# Altium project Second_Security.PrjPcb
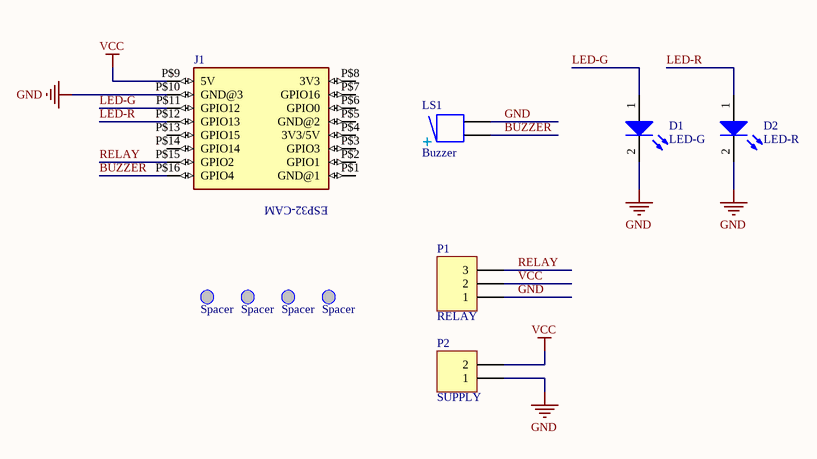
[diagram p0: SchematicDesign.SchDoc]
1 sheet, 10 parts. Net scope: global (net labels, ports and power ports of the same name join across sheets).
Board file: PCBDesign.PcbDoc

## Sheet SchematicDesign.SchDoc
size A4

### Parts
1  Spacer  [Spacer]
2  Spacer  [Spacer]
3  Spacer  [Spacer]
4  Spacer  [Spacer]
D1  LED-G  [LED]
D2  LED-R  [LED]
J1  ESP32-CAM  [ESP32-CAM]  (value not drawn)
LS1  Buzzer  [BUZZER]
P1  RELAY  [HDR1X3]
P2  SUPPLY  [Term.Block 2pin]

### Nets
GND: D1.2(K) D2.2(K) J1.P$10(GND@3) LS1.2 P1.1 P2.0(1)
VCC: J1.P$9(5V) P1.2 P2.1(2)
BUZZER: J1.P$16(GPIO4) LS1.1
LED-G: D1.1(A) J1.P$11(GPIO12)
LED-R: D2.1(A) J1.P$12(GPIO13)
RELAY: J1.P$15(GPIO2) P1.3

Not connected (* = marked no-connect by the designer): J1 P$1(GND@1) P$2(GPIO1) P$3(GPIO3) P$4(3V3/5V) P$5(GND@2) P$6(GPIO0) P$7(GPIO16) P$8(3V3) P$13(GPIO15) P$14(GPIO14)

### Library data of the parts
D1 D2 = LED: LED 3mm or 5mm; Published: 8-Jun-2000; LatestRevisionDate: 08-Jul-2005; LatestRevisionNote: Mech Layer 1 removed.; PackageReference: LED-1; Publisher: Altium Limited; PackageDescription: LED; 2 Leads
J1 = ESP32-CAM: ESP32 ESP32 Transceiver; 802.11 a/b/g/n (Wi-Fi, WiFi, WLAN), BluetoothÂ® Smart 4.x Low Energy (BLE) Evaluation Board; MF: AI-Thinker; SnapEDA_Link: https://www.snapeda.com/parts/ESP32-CAM/AI-Thinker/view-part/?ref=snap; Package: None; Value: *; MP: ESP32-CAM; Check_prices: https://www.snapeda.com/parts/ESP32-CAM/AI-Thinker/view-part/?ref=eda
LS1 = Buzzer: Magnetic Transducer Buzzer; Published: 24-Mar-1999; LatestRevisionDate: 17-Dec-2003; LatestRevisionNote: Schematic revised, PCB Footprint replaced.; DatasheetVersion: 17-Dec-2003; PackageReference: ABSM-1574; Publisher: Altium Limited; PackageDescription: Magnetic Transducer Buzzer; ComponentLink1Description: Manufacturer Link; ComponentLink1URL: http://www.megastar.com/linecard/buzzmode/index.php
P1 = Header 3: Header, 3-Pin; LatestRevisionDate: 17-Jul-2002; LatestRevisionNote: Re-released for DXP Platform.; Publisher: Altium Limited
P2 = Terminal Block 2pin: Terminal Block, 2-Pin; LatestRevisionDate: 17-Jul-2002; LatestRevisionNote: Re-released for DXP Platform.; Publisher: Altium Limited
1-4 = Spacer: Published: 8-Jun-2000; LatestRevisionDate: 17-Jul-2002; LatestRevisionNote: Re-released for DXP Platform.; PackageReference: R38; Publisher: Altium Limited; PackageDescription: Crystal, Thru-Hole; 2 Leads; Body 3.1 x 8.2 mm (Dia.xH)